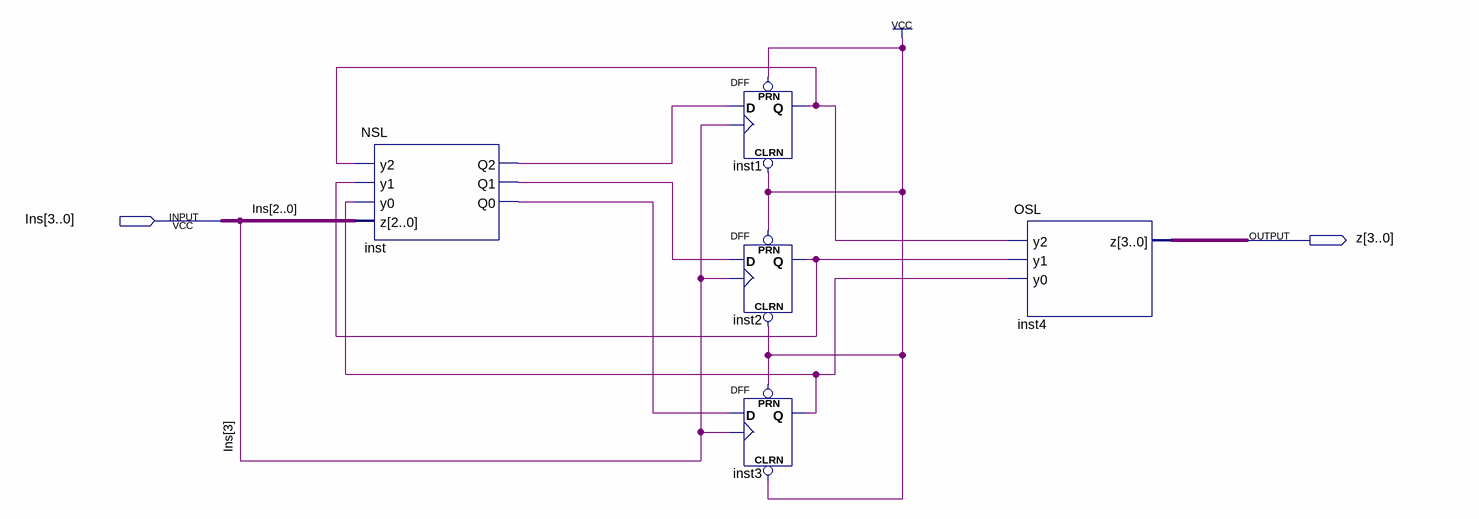
[diagram p0: schematic sheet]
// Quartus schematic StateMachine.bdf as structural Verilog: 5 symbols, 2 pins
module StateMachine (
  input  [3:0] Ins,
  output [3:0] z
);

  wire inst1_q, inst2_q, inst3_q, inst_q0, inst_q1, inst_q2;

  NSL inst (.y2(inst1_q), .y1(inst2_q), .y0(inst3_q), .z(Ins[2:0]), .Q2(inst_q2), .Q1(inst_q1), .Q0(inst_q0));
  DFF inst1 (.CLRN(1'b1), .CLK(Ins[3]), .D(inst_q2), .PRN(1'b1), .Q(inst1_q));
  DFF inst2 (.CLRN(1'b1), .CLK(Ins[3]), .D(inst_q1), .PRN(1'b1), .Q(inst2_q));
  DFF inst3 (.CLRN(1'b1), .CLK(Ins[3]), .D(inst_q0), .PRN(1'b1), .Q(inst3_q));
  OSL inst4 (.y2(inst1_q), .y1(inst2_q), .y0(inst3_q), .z(z));
endmodule
